# Altium schematic sheet Arduino RGB lamp beads.SchDoc
size A4
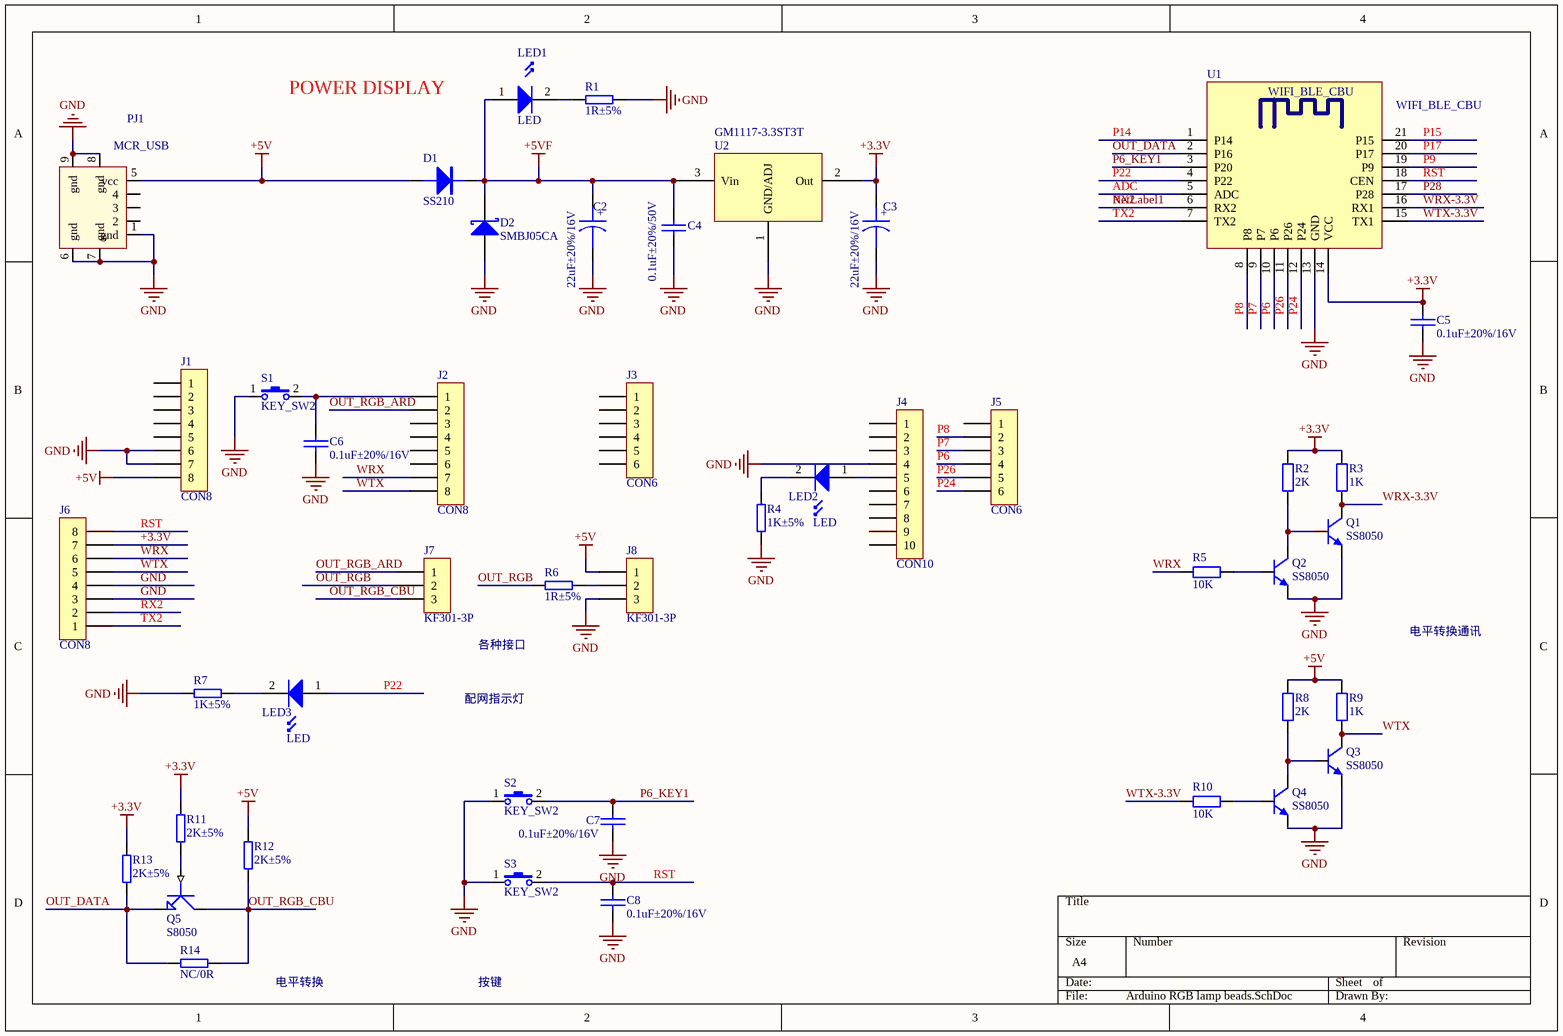
[diagram p0: Arduino RGB lamp beads.SchDoc]

## Parts
C2  22uF±20%/16V  [CD B(3528)]
C3  22uF±20%/16V  [CD B(3528)]
C4  0.1uF±20%/50V  [C 0603_M]
C5  0.1uF±20%/16V  [C 0603_M]
C6  0.1uF±20%/16V  [C 0603_M]
C7  0.1uF±20%/16V  [C 0603_M]
C8  0.1uF±20%/16V  [C 0603_M]
D1  SS210  [SMB]
D2  SMBJ05CA  [SMB]
J1  CON8  [HDR2.54-LI-8P]
J2  CON8  [HDR2.54-LI-8P]
J3  CON6  [HDR2.54-LI-6P]
J4  CON10  [HDR2.54-LI-10P]
J5  CON6  [HDR2.54-LI-6P]
J6  CON8  [HDR2.54-LI-8P]
J7  KF301-3P  [XH2.54-LI-3P]
J8  KF301-3P  [XH2.54-LI-3P]
LED1  LED  [LED 0603G]
LED2  LED  [LED 0603G]
LED3  LED  [LED 0603G]
PJ1  MCR_USB  [USB-MICRO_E]
Q1  SS8050  [SOT23-3M]
Q2  SS8050  [SOT23-3M]
Q3  SS8050  [SOT23-3M]
Q4  SS8050  [SOT23-3M]
Q5  S8050  [SOT-23-NPN]
R1  1R±5%  [R 0603_M]
R2  2K  [R 0603_M]
R3  1K  [R 0603_M]
R4  1K±5%  [R 0603_M]
R5  10K  [R 0603_M]
R6  1R±5%  [R 0603_M]
R7  1K±5%  [R 0603_M]
R8  2K  [R 0603_M]
R9  1K  [R 0603_M]
R10  10K  [R 0603_M]
R11  2K±5%  [R 0603_M]
R12  2K±5%  [R 0603_M]
R13  2K±5%  [R 0603_M]
R14  NC/0R  [R 0603_M]
S1  KEY_SW2  [TSW SMD-4*4*1.5]
S2  KEY_SW2  [KEY4-SMD]
S3  KEY_SW2  [KEY4-SMD]
U1  WIFI_BLE_CBU  [WIFI_BLE_CBU]
U2  GM1117-3.3ST3T  [SOT-223]

## Nets
+3.3V: C3.1 C5.2 J6.7 R2.1 R3.1 R11.1 R13.1 U1.14(VCC) U2.2(Out)
+5V: D1.1 J1.8 J8.1 PJ1.5(vcc) R8.1 R9.1 R12.1
+5VF: C2.1 C4.1 D1.2 D2.2(K) LED1.1 U2.3(Vin)
GND: C2.2 C3.2 C4.2 C5.1 C6.1 C7.1 C8.2 D2.1(A) J1.6 J1.7 J4.4 J6.3 J6.4 J8.3 PJ1.1(gnd) PJ1.6(gnd) PJ1.7(gnd) PJ1.8(gnd) PJ1.9(gnd) Q1.2(E) Q2.2(E) Q3.2(E) Q4.2(E) R1.2 R4.1 R7.2 S1.1 S2.1 S3.1 U1.13(GND) U2.1(GND/ADJ)
ADC: U1.5(ADC)
NetLabel1: J6.2 U1.6(RX2)  [also labelled RX2]
OUT_DATA: Q5.1(E) R13.2 R14.1 U1.2(P16)
OUT_RGB: J7.2 R6.1
OUT_RGB_ARD: J2.2 J7.1
OUT_RGB_CBU: J7.3 Q5.3(C) R12.2 R14.2
P6: J5.4 U1.10(P6)
P6_KEY1: C7.2 S2.2 U1.3(P20)
P7: J5.3 U1.9(P7)
P8: J5.2 U1.8(P8)
P9: U1.19(P9)
P14: U1.1(P14)
P15: U1.21(P15)
P17: U1.20(P17)
P22: LED3.1 U1.4(P22)
P24: J5.6 U1.12(P24)
P26: J5.5 U1.11(P26)
P28: U1.17(P28)
RST: C8.1 J6.8 S3.2 U1.18(CEN)
TX2: J6.1 U1.7(TX2)
WRX: J2.7 J6.6 R5.1
WRX-3.3V: Q1.3(C) R3.2 U1.16(RX1)
WTX: J2.8 J6.5 Q3.3(C) R9.2
WTX-3.3V: R10.1 U1.15(TX1)
NetC6_2: C6.2 J2.1 S1.2
NetJ4_5: J4.5 LED2.1
NetJ8_2: J8.2 R6.2
NetLED1_2: LED1.2 R1.1
NetLED2_2: LED2.2 R4.2
NetLED3_2: LED3.2 R7.1
NetQ1_1: Q1.1(B) Q2.3(C) R2.2
NetQ2_1: Q2.1(B) R5.2
NetQ3_1: Q3.1(B) Q4.3(C) R8.2
NetQ4_1: Q4.1(B) R10.2
NetQ5_2: Q5.2(B) R11.2

Not connected (* = marked no-connect by the designer): J1 1 2 3 4 5; J2 3 4 5 6; J3 1 2 3 4 5 6; J4 1 2 3 6 7 8 9 10; J5 1; PJ1 2 3 4

## Notes on the sheet
- POWER DISPLAY
- 各种接口
- 电平转换通讯
- 配网指示灯
- 电平转换
- 按键
- (in symbol CAPACITOR POL) +

## Library data of the parts
C2 C3 = CAPACITOR POL: Capacitor
C4-C8 = CAP: Capacitor
D1 = Diode1: Diode
D2 = D Schottky: Schottky Diode; MFR: Toshiba
J1 J2 J6 = CON8: Connector
J3 J5 = CON6: Connector
J4 = CON10: Connector
J7 J8 = CON3: Connector
Q1-Q4 = 8050-SMD: 高频放大-NPN型; 版权归属: 源创客; 属性: 40V 1.5A 1W 100MHZ; BOM名称: 高频放大-NPN型; 学习资源: www.ooocke.com
Q5 = NPN: NPN Transistor
R1 R4 R6 R7 R11-R14 = RES5
R2 R3 R5 R8-R10 = R: 贴片电阻; 版权归属: 源创客; BOM名称: 贴片电阻; 学习资源: www.ooocke.com
U1 = WIFI_BLE_CBU: Module
U2 = GM1117
LED1-LED3 = LED: Published: *; LatestRevisionDate: *; LatestRevisionNote: *; DatasheetDocument: *; PackageDocument: *; PackageReference: *; Publisher: *; ComponentLink1Description: *; ComponentLink1URL: *; Code_JEDEC: *
PJ1 = MCR_USB: Published: *; Revision 1: *; Revision 2: *; Datasheet: *; Publisher: *